# Altium schematic sheet [F_V1]_CommMunication_Sheet.SchDoc
size A2; SheetNumber: 4; SheetTotal: 5
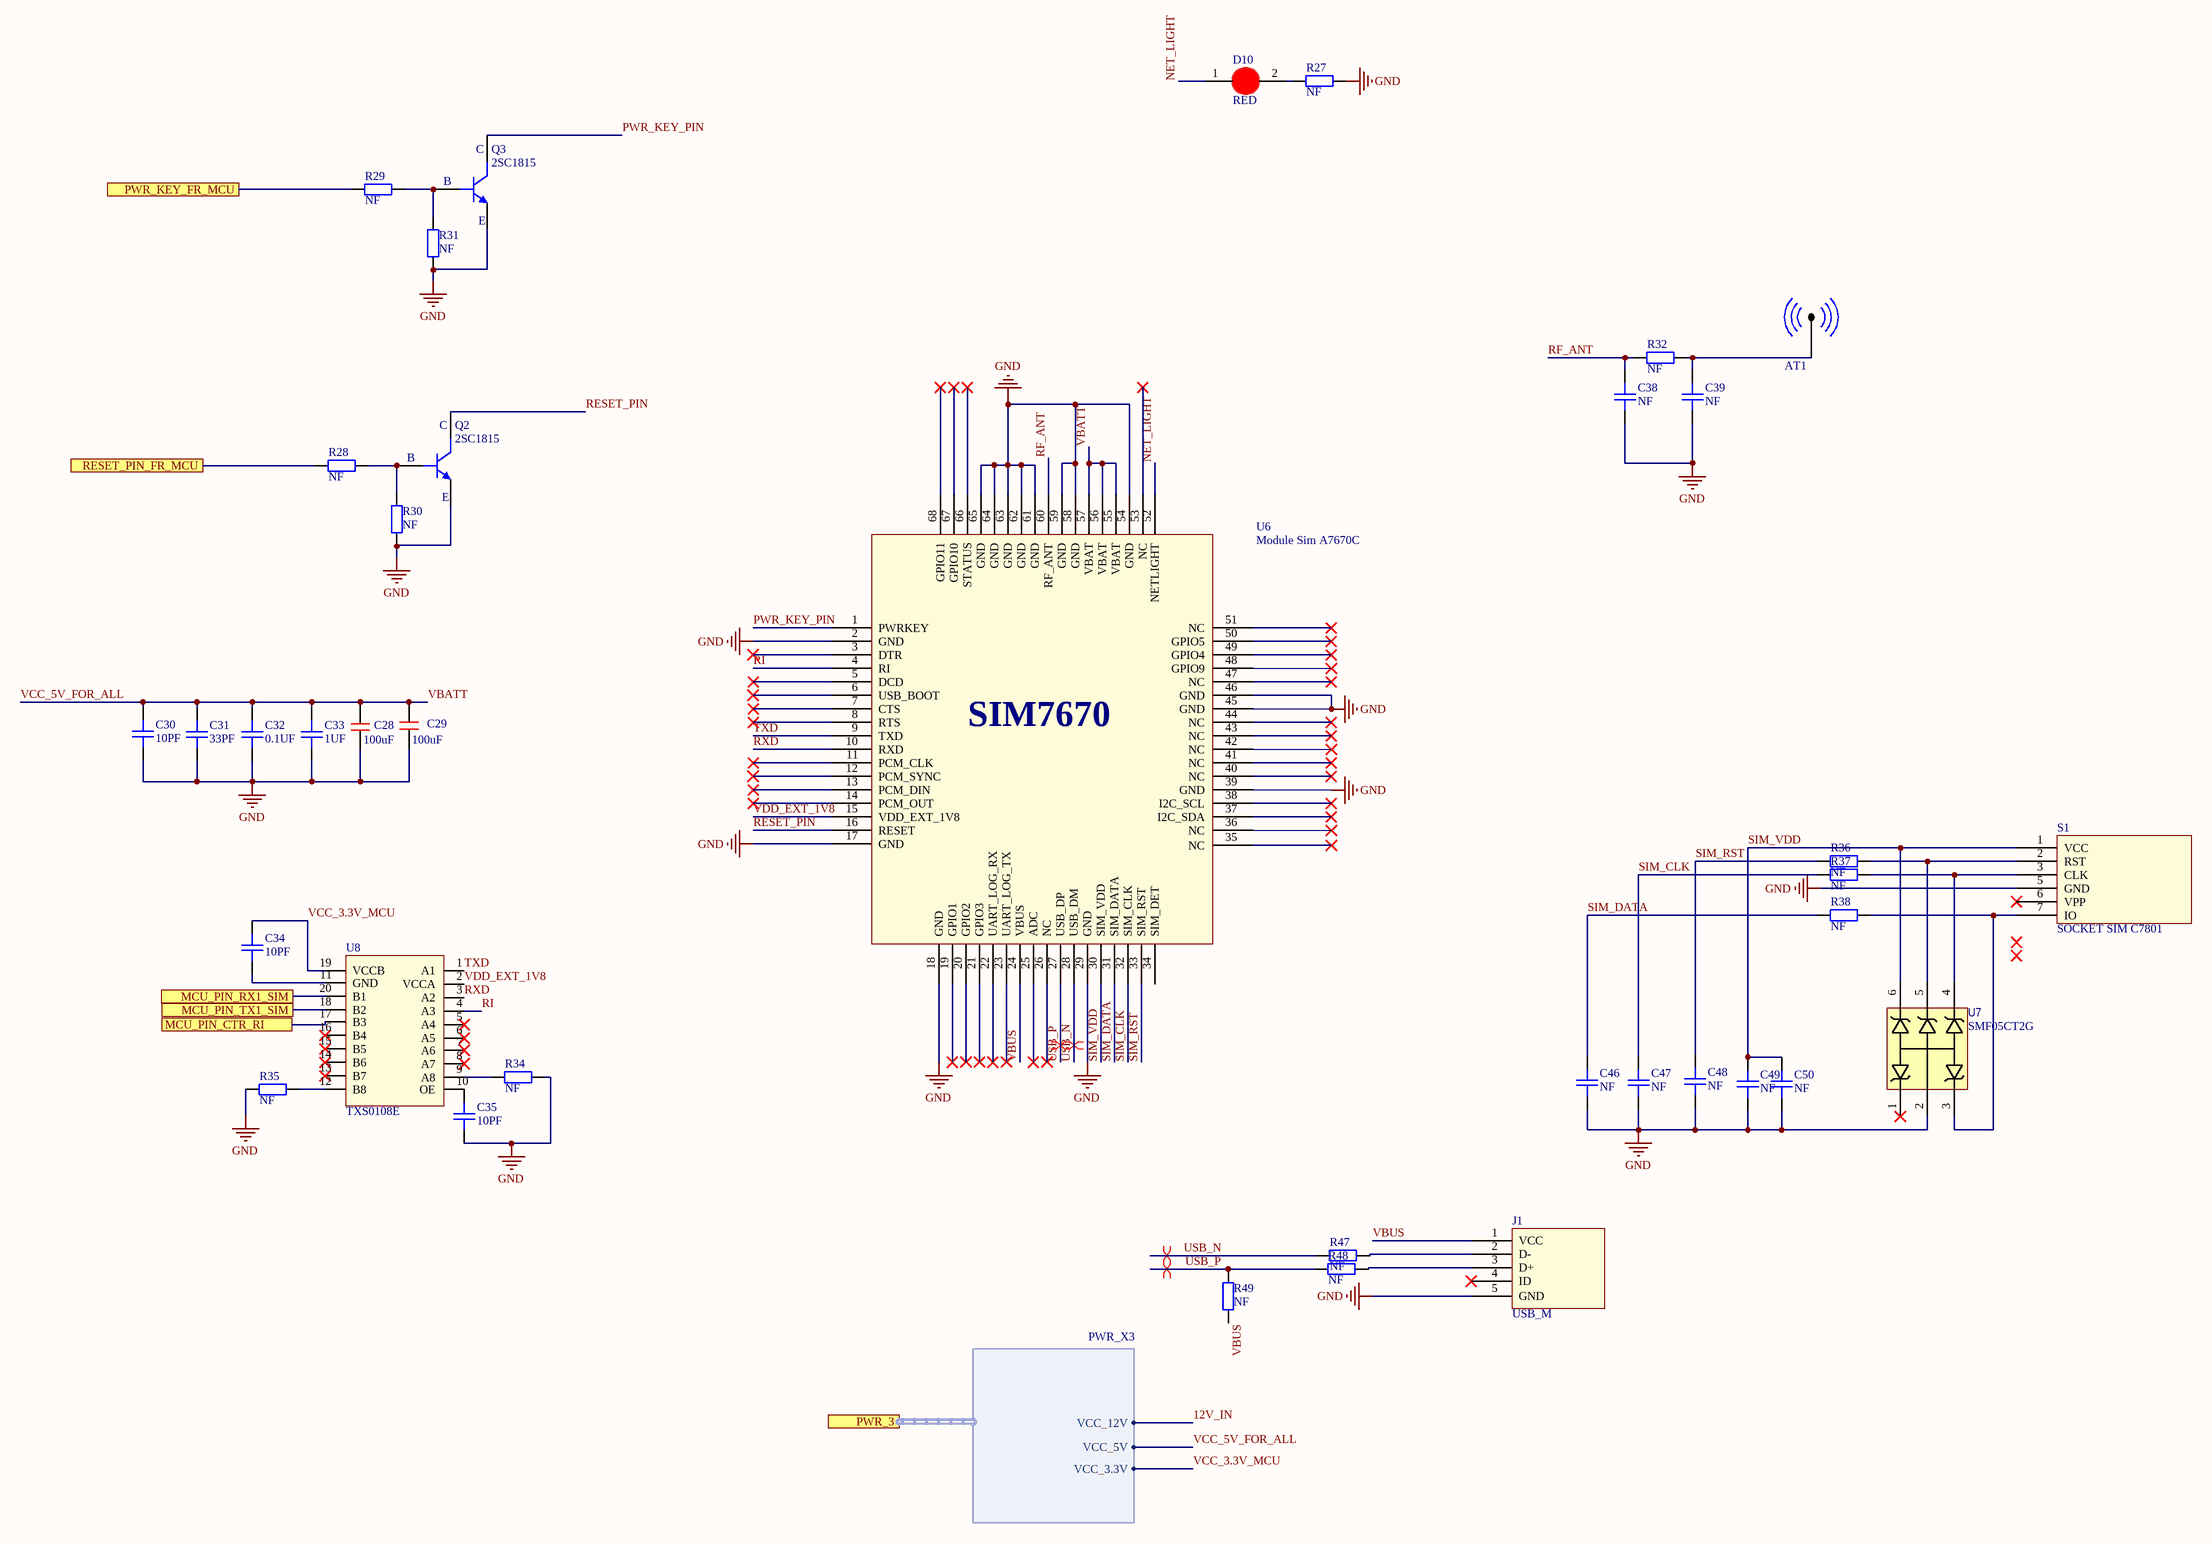
[diagram p0: [F_V1]_CommMunication_Sheet.SchDoc]

## Parts
AT1  AT-GSM-GPS  [ANTENA - SMA2]  (value not drawn)
C28  100uF  [100uF 1210 SMD]
C29  100uF  [100uF 1210 SMD]
C30  10PF  [CAPC-0603 (1608)]
C31  33PF  [CAPC-0603 (1608)]
C32  0.1UF  [CAPC-0603 (1608)]
C33  1UF  [CAPC-0603 (1608)]
C34  10PF  [CAPC-0603 (1608)]
C35  10PF  [CAPC-0603 (1608)]
C38  NF  [CAPC-0603 (1608)]
C39  NF  [CAPC-0603 (1608)]
C46  NF  [CAPC-0603 (1608)]
C47  NF  [CAPC-0603 (1608)]
C48  NF  [CAPC-0603 (1608)]
C49  NF  [CAPC-0603 (1608)]
C50  NF  [CAPC-0603 (1608)]
D10  RED  [LED_0603_RED]
J1  USB_M  [USB_M]
Q2  2SC1815  [SOT23_3]
Q3  2SC1815  [SOT23_3]
R27  NF  [RESC-0603 (1608)]
R28  NF  [RESC-0603 (1608)]
R29  NF  [RESC-0603 (1608)]
R30  NF  [RESC-0603 (1608)]
R31  NF  [RESC-0603 (1608)]
R32  NF  [RESC-0603 (1608)]
R34  NF  [RESC-0603 (1608)]
R35  NF  [RESC-0603 (1608)]
R36  NF  [RESC-0603 (1608)]
R37  NF  [RESC-0603 (1608)]
R38  NF  [RESC-0603 (1608)]
R47  NF  [RESC-0603 (1608)]
R48  NF  [RESC-0603 (1608)]
R49  NF  [RESC-0603 (1608)]
S1  SOCKET SIM C7801  [SOCKET SIM]
U6  Module Sim A7670C  [Module Sim A7670C]
U7  SMF05CT2G  [SOT65P210X140-6N]
U8  TXS0108E  [TXS0108E]

## Ports
MCU_PIN_CTR_RI, MCU_PIN_RX1_SIM, MCU_PIN_TX1_SIM, PWR_3 (harness PWR_X3), PWR_KEY_FR_MCU, RESET_PIN_FR_MCU

## Harnesses
PWR_X3: VCC_12V, VCC_5V, VCC_3.3V

## Nets
GND: C28.1 C29.1 C30.1 C31.1 C32.1 C33.1 C35.1 C38.1 C39.1 C46.1 C47.1 C48.1 C49.1 C50.1 J1.5(GND) Q2.2(E) Q3.2(E) R27.1 R30.2 R31.2 R34.1 R35.2 S1.5(GND) U6.2(GND) U6.17(GND) U6.18(GND) U6.29(GND) U6.39(GND) U6.45(GND) U6.46(GND) U6.54(GND) U6.58(GND) U6.59(GND) U6.61(GND) U6.62(GND) U6.63(GND) U6.64(GND) U6.65(GND) U7.2(AN)
12V_IN: port PWR_3.VCC_12V
MCU_PIN_CTR_RI: U8.17(B3) ; port MCU_PIN_CTR_RI
MCU_PIN_RX1_SIM: U8.20(B1) ; port MCU_PIN_RX1_SIM
MCU_PIN_TX1_SIM: U8.18(B2) ; port MCU_PIN_TX1_SIM
NET_LIGHT: D10.1(A) U6.52(NETLIGHT)
PWR_KEY_FR_MCU: R29.2 ; port PWR_KEY_FR_MCU
PWR_KEY_PIN: Q3.3(C) U6.1(PWRKEY)
RESET_PIN: Q2.3(C) U6.16(RESET)
RESET_PIN_FR_MCU: R28.2 ; port RESET_PIN_FR_MCU
RF_ANT: C38.2 R32.2 U6.60(RF_ANT)
RI: U6.4(RI) U8.4(A3)
RXD: U6.10(RXD) U8.3(A2)
SIM_CLK: C47.2 R37.2 U6.32(SIM_CLK)
SIM_DATA: C46.2 R38.2 U6.31(SIM_DATA)
SIM_RST: C48.2 R36.2 U6.33(SIM_RST)
SIM_VDD: C49.2 C50.2 S1.1(VCC) U6.30(SIM_VDD) U7.6(CT5)
TXD: U6.9(TXD) U8.1(A1)
USB_N: R47.2 U6.28(USB_DM)
USB_P: R48.2 R49.1 U6.27(USB_DP)
VBATT: C28.2 C29.2 C30.2 C31.2 C32.2 C33.2 U6.55(VBAT) U6.56(VBAT) U6.57(VBAT) ; port PWR_3.VCC_5V  [also labelled VCC_5V_FOR_ALL]
VBUS: J1.1(VCC) R49.2 U6.24(VBUS)
VCC_3.3V_MCU: C34.2 U8.19(VCCB) ; port PWR_3.VCC_3.3V
VDD_EXT_1V8: U6.15(VDD_EXT_1V8) U8.2(VCCA)
NetAT1_1: AT1.1(AT) C39.2 R32.1
NetC34_1: C34.1 U8.11(GND)
NetC35_2: C35.2 U8.10(OE)
NetD10_2: D10.2(K) R27.2
NetJ1_2: J1.2(D-) R47.1
NetJ1_3: J1.3(D+) R48.1
NetQ2_1: Q2.1(B) R28.1 R30.1
NetQ3_1: Q3.1(B) R29.1 R31.1
NetR34_2: R34.2 U8.9(A8)
NetR35_1: R35.1 U8.12(B8)
NetR36_1: R36.1 S1.2(RST) U7.5(CT4)
NetR37_1: R37.1 S1.3(CLK) U7.4(CT3)
NetR38_1: R38.1 S1.7(IO) U7.3(CT2)

Not connected (* = marked no-connect by the designer): AT1 2; J1 4(ID)*; S1 6(VPP)*; U6 3(DTR)* 5(DCD)* 6(USB_BOOT)* 7(CTS)* 8(RTS)* 11(PCM_CLK)* 12(PCM_SYNC)* 13(PCM_DIN)* 14(PCM_OUT)* 19(GPIO1)* 20(GPIO2)* 21(GPIO3)* 22(UART_LOG_RX)* 23(UART_LOG_TX)* 25(ADC)* 26(NC)* 34(SIM_DET) 35(NC)* 36(NC)* 37(I2C_SDA)* 38(I2C_SCL)* 40(NC)* 41(NC)* 42(NC)* 43(NC)* 44(NC)* 47(NC)* 48(GPIO9)* 49(GPIO4)* 50(GPIO5)* 51(NC)* 53(NC)* 66(STATUS)* 67(GPIO10)* 68(GPIO11)*; U7 1(CT1)*; U8 5(A4)* 6(A5)* 7(A6)* 8(A7)* 13(B7)* 14(B6)* 15(B5)* 16(B4)*

## Layout directives
differential pair; net class USB_CLS: USB_N, USB_P

## Notes on the sheet
- (in symbol Module Sim A7670C) SIM7670

## Library data of the parts
AT1 = RFCON171003SF6B001: CONNECTER ANTENNA GPS GSM; Solder: HAND; CompanyID: VT-00392; MPN: RFCON171003SF6B001; Value: AT-GSM-GPS
C28 C29 = CAP SMD 1210 100uF
C30-C35 = CAPC NF 0603: CAP SMD, Not Fill, 0603; Value: NF; Solder: Not Fill; Category: CAPACITOR
C38 C39 C46-C50 = CAPC NF 0603: CAP SMD, Not Fill, 0603; Solder: Not Fill; Value: NF; Category: CAPACITOR
D10 = LED RED 0603: LED RED 0603 SMD; Solder: SMT; Value: RED; Category: *
Q2 Q3 = 2SC1815: TRANS NPN 50V 0.15A SOT23-3; Solder: SMT; MPN: 2SC1815; Value: 2SC1815
R27-R32 R34-R38 R47-R49 = RESC NF 0603: RES SMD, Not Fill, 0603; Solder: Not Fill; Value: NF; Category: RESISTOR
U7 = SMF05C: TVS Diode Array For ESD and Latch-Up Protection; MFR: ON SEMICONDUCTOR; Solder: SMT; CompanyID: VT-0; MPN: SMF05CT2G; Category: IC; Value: SMF05CT2G